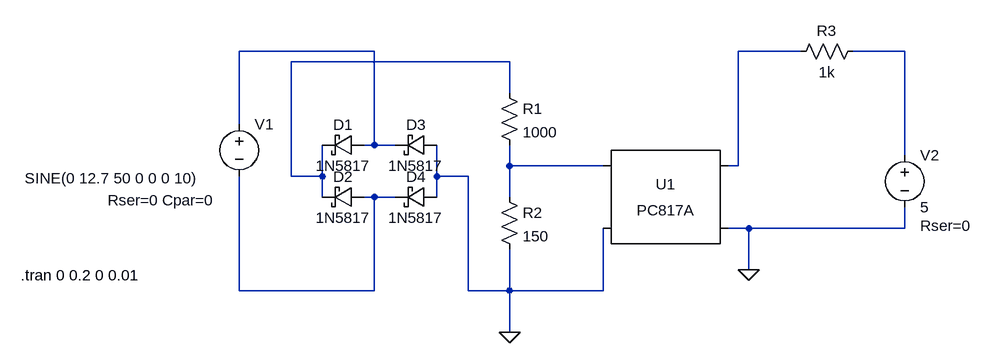
[diagram p0: schematic ZCD_Sim.asc]
ZCD_Sim.asc, the LTspice schematic file:
Version 4
SHEET 1 1136 680
WIRE 208 0 0 0
WIRE 864 0 768 0
WIRE 1024 0 944 0
WIRE 416 16 80 16
WIRE 416 64 416 16
WIRE 0 112 0 0
WIRE 208 144 208 0
WIRE 208 144 192 144
WIRE 240 144 208 144
WIRE 1024 160 1024 0
WIRE 416 176 416 144
WIRE 560 176 416 176
WIRE 768 176 768 0
WIRE 768 176 752 176
WIRE 80 192 80 16
WIRE 128 192 128 144
WIRE 128 192 80 192
WIRE 304 192 304 144
WIRE 352 192 304 192
WIRE 128 224 128 192
WIRE 208 224 192 224
WIRE 240 224 208 224
WIRE 304 224 304 192
WIRE 416 224 416 176
WIRE 784 272 752 272
WIRE 1024 272 1024 240
WIRE 1024 272 784 272
WIRE 784 336 784 272
WIRE 0 368 0 192
WIRE 208 368 208 224
WIRE 208 368 0 368
WIRE 352 368 352 192
WIRE 416 368 416 304
WIRE 416 368 352 368
WIRE 560 368 560 272
WIRE 560 368 416 368
WIRE 416 432 416 368
FLAG 784 336 0
FLAG 416 432 0
SYMBOL voltage 0 96 R0
WINDOW 3 -330 99 Left 2
WINDOW 123 0 0 Left 0
WINDOW 39 -202 133 Left 2
SYMATTR Value SINE(0 12.7 50 0 0 0 10)
SYMATTR SpiceLine Rser=0 Cpar=0
SYMATTR InstName V1
SYMBOL res 400 48 R0
SYMATTR InstName R1
SYMATTR Value 1000
SYMATTR SpiceLine tol=5 pwr=0.25
SYMBOL res 400 208 R0
SYMATTR InstName R2
SYMATTR Value 150
SYMATTR SpiceLine tol=5 pwr=0.25
SYMBOL Optos\\PC817A 656 224 R0
SYMATTR InstName U1
SYMBOL voltage 1024 144 R0
WINDOW 123 0 0 Left 0
WINDOW 39 24 124 Left 2
SYMATTR SpiceLine Rser=0
SYMATTR InstName V2
SYMATTR Value 5
SYMBOL res 960 -16 R90
WINDOW 0 0 56 VBottom 2
WINDOW 3 32 56 VTop 2
SYMATTR InstName R3
SYMATTR Value 1k
SYMBOL schottky 192 128 R90
WINDOW 0 0 32 VBottom 2
WINDOW 3 32 32 VTop 2
SYMATTR InstName D1
SYMATTR Value 1N5817
SYMATTR Description Diode
SYMATTR Type diode
SYMBOL schottky 192 208 R90
WINDOW 0 0 32 VBottom 2
WINDOW 3 32 32 VTop 2
SYMATTR InstName D2
SYMATTR Value 1N5817
SYMATTR Description Diode
SYMATTR Type diode
SYMBOL schottky 304 128 R90
WINDOW 0 0 32 VBottom 2
WINDOW 3 32 32 VTop 2
SYMATTR InstName D3
SYMATTR Value 1N5817
SYMATTR Description Diode
SYMATTR Type diode
SYMBOL schottky 304 208 R90
WINDOW 0 0 32 VBottom 2
WINDOW 3 32 32 VTop 2
SYMATTR InstName D4
SYMATTR Value 1N5817
SYMATTR Description Diode
SYMATTR Type diode
TEXT -336 344 Left 2 !.tran 0 0.2 0 0.01

The netlist it stands for:
* ZCD_Sim.asc
V1 N001 N006 SINE(0 12.7 50 0 0 0 10) Rser=0 Cpar=0
R1 N004 N005 1000 tol=5 pwr=0.25
R2 N005 0 150 tol=5 pwr=0.25
XU1 N005 0 N002 0 PC817 Igain=1m
V2 N003 0 5 Rser=0
R3 N003 N002 1k
D1 N001 N004 1N5817
D2 N006 N004 1N5817
D3 0 N001 1N5817
D4 0 N006 1N5817
.model D D
.lib standard.dio
.tran 0 0.2 0 0.01
.lib PC817.sub
.backanno
.end